# Altium schematic sheet main.SchDoc
size A; SheetNumber: 1; SheetTotal: 1
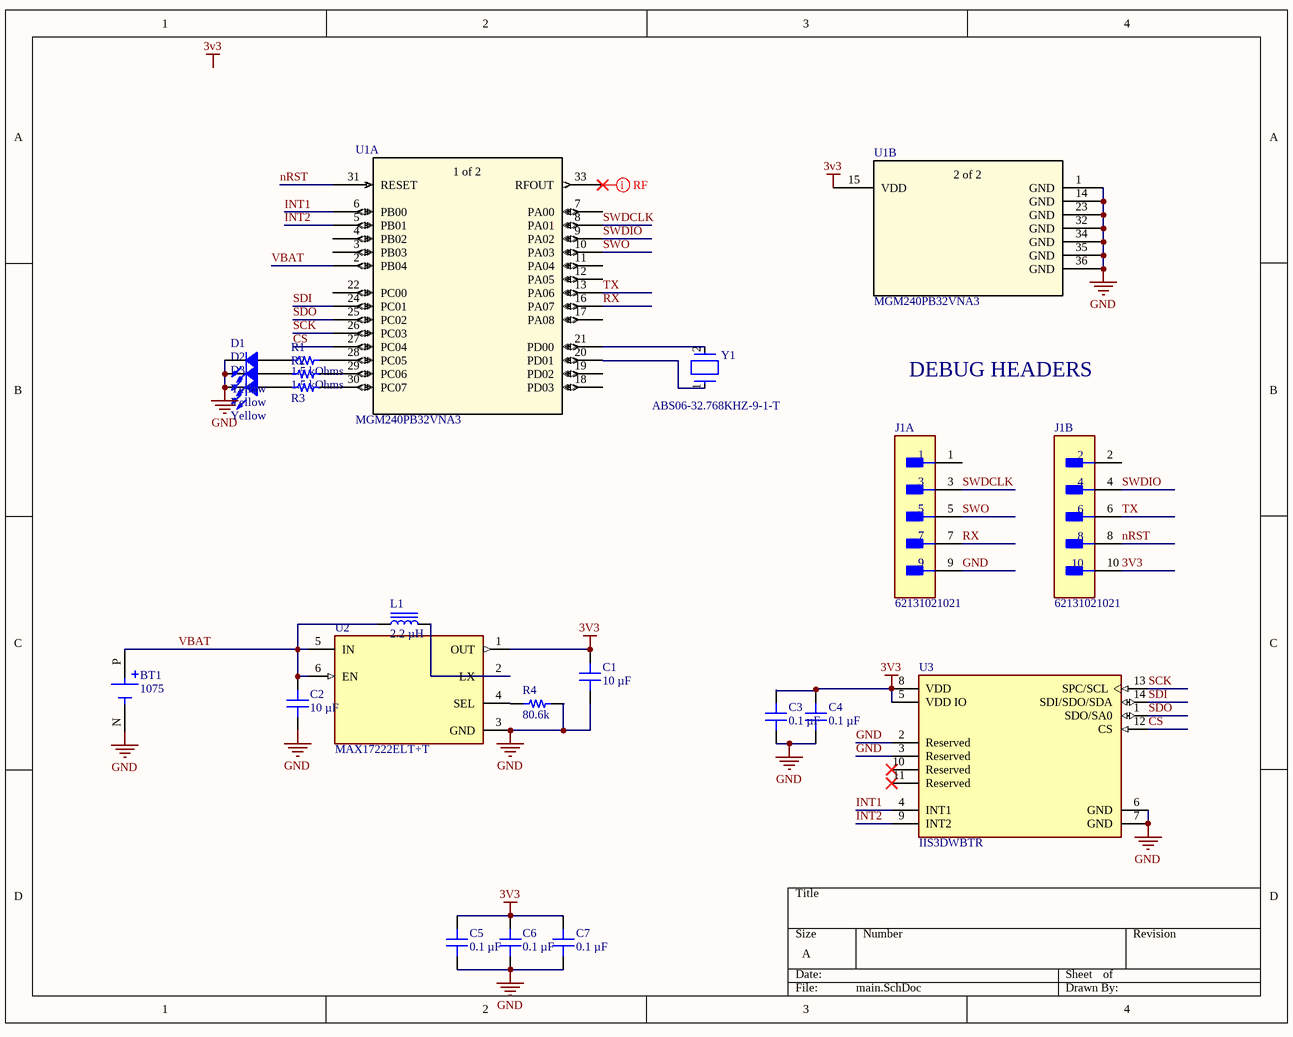
[diagram p0: main.SchDoc]

## Parts
BT1  1075  [BAT_1075]
C1  10 µF  [CAP 0402_1005]
C2  10 µF  [CAP 0402_1005]
C3  0.1 µF  [CAP 0402_1005]
C4  0.1 µF  [CAP 0402_1005]
C5  0.1 µF  [CAP 0402_1005]
C6  0.1 µF  [CAP 0402_1005]
C7  0.1 µF  [CAP 0402_1005]
D1  Yellow  [LED 0402_1005 YELLOW]
D2  Yellow  [LED 0402_1005 YELLOW]
D3  Yellow  [LED 0402_1005 YELLOW]
J1  62131021021  [FP-62131021021-MFG]  (parts A,B of 2)
L1  2.2 µH  [TDK VLS201612CX]
R1  1.5 kOhms  [RES 0402_1005]
R2  1.5 kOhms  [RES 0402_1005]
R3  (no value)  [RES 0402_1005]
R4  80.6k  [RES 0402_1005]
U1  MGM240PB32VNA3  [xGM240P]  (parts A,B of 2)
U2  MAX17222ELT+T  [FP-L622-1C-IPC_B]
U3  IIS3DWBTR  [FP-LGA-14L-DM00249496-MFG]
Y1  ABS06-32.768KHZ-9-1-T  [FP-ABS06-MFG]

## Nets
3V3: C1.1 C3.2 C4.2 C5.2 C6.2 C7.2 J1.10 U1.15(VDD) U2.1(OUT) U3.5(VDD_IO) U3.8(VDD)
GND: BT1.N(NEG) C1.2 C2.2 C3.1 C4.1 C5.1 C6.1 C7.1 D1.2 D2.2 D3.2 J1.9 R4.1 U1.1(GND) U1.14(GND) U1.23(GND) U1.32(GND) U1.34(GND) U1.35(GND) U1.36(GND) U2.3(GND) U3.2(Reserved) U3.3(Reserved) U3.6(GND) U3.7(GND)
CS: U1.27(PC04) U3.12(CS)
INT1: U1.6(PB00) U3.4(INT1)
INT2: U1.5(PB01) U3.9(INT2)
nRST: J1.8 U1.31(RESET)
RX: J1.7 U1.16(PA07)
SCK: U1.26(PC03) U3.13(SPC/SCL)
SDI: U1.24(PC01) U3.14(SDI/SDO/SDA)
SDO: U1.25(PC02) U3.1(SDO/SA0)
SWDCLK: J1.3 U1.8(PA01)
SWDIO: J1.4 U1.9(PA02)
SWO: J1.5 U1.10(PA03)
TX: J1.6 U1.13(PA06)
VBAT: BT1.P(POS) C2.1 L1.1 U1.2(PB04) U2.5(IN) U2.6(EN)
NetD1_1: D1.1 R1.1
NetD2_1: D2.1 R2.1
NetD3_1: D3.1 R3.1
NetL1_2: L1.2 U2.2(LX)
NetR1_2: R1.2 U1.28(PC05)
NetR2_2: R2.2 U1.29(PC06)
NetR3_2: R3.2 U1.30(PC07)
NetR4_2: R4.2 U2.4(SEL)
NetU1_20: U1.20(PD01) Y1.1
NetU1_21: U1.21(PD00) Y1.2

Not connected (* = marked no-connect by the designer): J1 1 2; U1 3(PB03) 4(PB02) 7(PA00) 11(PA04) 12(PA05) 17(PA08) 18(PD03) 19(PD02) 22(PC00) 33(RFOUT)*; U3 10(Reserved)* 11(Reserved)*

## Layout directives
mark named RF: NetU1_33

## Notes on the sheet
- DEBUG HEADERS
- Labels drawn without touching a wire or pin: 3v3
- (in symbol MGM240PB32VNA3, part A) 1 of 2
- (in symbol MGM240PB32VNA3, part B) 2 of 2

## Library data of the parts
BT1 = CMP-342-000000-1: Price: None; Pin Count: 2; Package: None; Availability: Unavailable; MP: 1075; Value: *; Source: 1075.SchLib; Design Item ID: 1075; Component Type: Standard
C1 C2 = C0402C104K7PAC7867: CAP CER 0.1UF 4V X5R 0402; manufacturer: KEMET; Capacitance: 0.1 µF; Tolerance: ±10%; Part Number: C0402C104K7PAC7867; Value: 10 µF; Applications: Bypass, Decoupling; componentlink1description: Datasheet; componentlink1url: https://api.kemet.com/component-edge/download/datasheet/C0402C104K7PAC7867.pdf; componentlink2description: DigiKey Link; componentlink2url: https://www.digikey.com/en/products/detail/kemet/C0402C104K7PAC7867/7381987; Device Package: 0402 (1005 Metric); lastupdated: 1/9/2022 12:30:40 pm; Lifecycle Status: Active; Minimum Order: 1; Mounting Type: Surface Mount, MLCC; Operating Temperature: -55°C ~ 85°C; Package / Case: 0402 (1005 Metric); packaging: TapeAndReel; partid: 5603; Part Status: Active; price: 0.01; series: SMD Comm X5R; Size / Dimension: 0.039" L x 0.020" W (1.00mm x 0.50mm); Supplier 1: DigiKey; Supplier Part Number 1: 399-14871-1-ND; Temperature Coefficient: X5R; Thickness (Max): 0.022" (0.55mm); Voltage - Rated: 4V
C3 C4 C6 C7 = C0402C104K7PAC7867: CAP CER 0.1UF 4V X5R 0402; manufacturer: KEMET; Tolerance: ±10%; Part Number: C0402C104K7PAC7867; Value: 0.1 µF; Applications: Bypass, Decoupling; Capacitance: 0.1 µF; componentlink1description: Datasheet; componentlink1url: https://api.kemet.com/component-edge/download/datasheet/C0402C104K7PAC7867.pdf; componentlink2description: DigiKey Link; componentlink2url: https://www.digikey.com/en/products/detail/kemet/C0402C104K7PAC7867/7381987; Device Package: 0402 (1005 Metric); lastupdated: 1/9/2022 12:30:40 pm; Lifecycle Status: Active; Minimum Order: 1; Mounting Type: Surface Mount, MLCC; Operating Temperature: -55°C ~ 85°C; Package / Case: 0402 (1005 Metric); packaging: TapeAndReel; partid: 5603; Part Status: Active; price: 0.01; series: SMD Comm X5R; Size / Dimension: 0.039" L x 0.020" W (1.00mm x 0.50mm); Supplier 1: DigiKey; Supplier Part Number 1: 399-14871-1-ND; Temperature Coefficient: X5R; Thickness (Max): 0.022" (0.55mm); Voltage - Rated: 4V
C5 = C0402C104K4RECAUTO: CAP CER 0402 0.1UF 16V X7R 10%; manufacturer: KEMET; Part Number: C0402C104K4RECAUTO; Value: 0.1 µF; Applications: Automotive, ESD Protection; Capacitance: 0.1 µF; componentlink1description: Datasheet; componentlink1url: https://api.kemet.com/component-edge/download/datasheet/C0402C104K4RECAUTO.pdf; componentlink2description: DigiKey Link; componentlink2url: https://www.digikey.com/en/products/detail/kemet/C0402C104K4RECAUTO/8563695; Device Package: 0402 (1005 Metric); lastupdated: 1/9/2022 12:30:53 pm; Lifecycle Status: Active; Minimum Order: 1; Mounting Type: Surface Mount, MLCC; Operating Temperature: -55°C ~ 125°C; Package / Case: 0402 (1005 Metric); packaging: TapeAndReel; partid: 1731; Part Status: Active; price: 0.01; Ratings: AEC-Q200; series: ESD SMD Auto X7R; Size / Dimension: 0.039" L x 0.020" W (1.00mm x 0.50mm); Supplier 1: DigiKey; Supplier Part Number 1: 399-17167-1-ND; Temperature Coefficient: X7R; Thickness (Max): 0.022" (0.55mm); Tolerance: ±10%; Voltage - Rated: 16V
D1-D3 = BL-HKC37A-AV-TRB: 0402 YELLOW; Manufacturer: American Bright Optoelectronics Corporation; Configuration: Standard; Current - Test: 20mA; Lens Color: Colorless; Lens Style: Rectangle with Flat Top; Lens Transparency: Clear; Millicandela Rating: 120mcd; Viewing Angle: 120°; Voltage - Forward (Vf) (Typ): 2.2V; Wavelength - Dominant: 589nm; Wavelength - Peak: 590nm; Part Number: BL-HKC37A-AV-TRB; Color: Yellow; ComponentLink1Description: Datasheet; ComponentLink1URL: https://americanbrightled.com/pdffiles/smt/BL-HKC37A-AV-TRB.pdf; ComponentLink2Description: DigiKey Link; ComponentLink2URL: https://www.digikey.com/en/products/detail/american-bright-optoelectronics-corporation/BL-HKC37A-AV-TRB/9678171; Device Package: 0402 (1005 Metric); Height (Max): 0.45mm; LastUpdated: 11/9/2022 10:29:51 am; Lifecycle Status: Active; Minimum Order: 1; Mounting Type: Surface Mount; Package / Case: 0402 (1005 Metric); Packaging: TapeAndReel; PartId: 1041; Part Status: Active; Price: 0.06; Series: -; Size / Dimension: 1.00mm L x 0.50mm W; Supplier 1: DigiKey; Supplier Part Number 1: BL-HKC37A-AV-TRBCT-ND; Supplier Device Package: 0402; Value: Yellow
J1 = CMP-1502-00938-2: 1.27mm SMT Straight Dual Pin Header WR-PHD; RoHS Compliant: Yes
L1 = VLS201612CX-6R8M-1: FIXED IND 6.8UH 930MA 368MOHM SM; Manufacturer: TDK Corporation; Current - Saturation: 730mA; DC Resistance (DCR): 368mOhm Max; Inductance: 6.8 µH; Inductance Frequency - Test: 1 MHz; Material - Core: Ferrite; Shielding: Shielded; Tolerance: ±20%; Type: Drum Core, Wirewound; Part Number: VLS201612CX-6R8M-1; ComponentLink1Description: Datasheet; ComponentLink1URL: https://product.tdk.com/info/en/catalog/datasheets/inductor_commercial_power_vls201612cx-1_en.pdf?ref_disty=digikey; ComponentLink2Description: DigiKey Link; ComponentLink2URL: https://www.digikey.com/en/products/detail/tdk-corporation/VLS201612CX-6R8M-1/5169771; Current Rating (Amps): 930 mA; Device Package: Nonstandard; Height - Seated (Max): 0.047" (1.20mm); LastUpdated: 11/9/2022 10:31:03 am; Lifecycle Status: Active; Minimum Order: 1; Mounting Type: Surface Mount; Operating Temperature: -40°C ~ 105°C; Package / Case: Nonstandard; Packaging: TapeAndReel; PartId: 207; Part Status: Active; Price: 0.13; Series: VLS-CX-1; Size / Dimension: 0.079" L x 0.063" W (2.00mm x 1.60mm); Supplier 1: DigiKey; Supplier Part Number 1: 445-172966-1-ND; Supplier Device Package: 2016; Value: 2.2 µH
R1 R2 = ERA-2VRW1501X: RES 1.5K OHM 0.05% 1/10W 0402; Manufacturer: Panasonic Electronic Components; Power (Watts): 0.1W, 1/10W; Temperature Coefficient: ±10ppm/°C; Part Number: ERA-2VRW1501X; Value: 1.5 kOhms; ComponentLink1Description: Datasheet; ComponentLink1URL: https://api.pim.na.industrial.panasonic.com/file_stream/main/fileversion/9152; ComponentLink2Description: DigiKey Link; ComponentLink2URL: https://www.digikey.com/en/products/detail/panasonic-electronic-components/ERA-2VRW1501X/12086957; Composition: Thin Film; Device Package: 0402 (1005 Metric); Features: Anti-Sulfur, Automotive AEC-Q200; Height - Seated (Max): 0.016" (0.40mm); LastUpdated: 11/9/2022 9:53:08 am; Lifecycle Status: Active; Minimum Order: 1; Number of Terminations: 2; Operating Temperature: -55°C ~ 155°C; Package / Case: 0402 (1005 Metric); Packaging: TapeAndReel; PartId: 67400; Part Status: Active; Price: 0.24; Ratings: AEC-Q200; Resistance: 1.5 kOhms; Series: ERA-2V; Size / Dimension: 0.039" L x 0.020" W (1.00mm x 0.50mm); Supplier 1: DigiKey; Supplier Part Number 1: 10-ERA-2VRW1501XCT-ND; Supplier Device Package: 0402; Tolerance: ±0.05%
R3 R4 = ERA-2VRW1501X: RES 1.5K OHM 0.05% 1/10W 0402; Manufacturer: Panasonic Electronic Components; Power (Watts): 0.1W, 1/10W; Resistance: 1.5 kOhms; Temperature Coefficient: ±10ppm/°C; Part Number: ERA-2VRW1501X; ComponentLink1Description: Datasheet; ComponentLink1URL: https://api.pim.na.industrial.panasonic.com/file_stream/main/fileversion/9152; ComponentLink2Description: DigiKey Link; ComponentLink2URL: https://www.digikey.com/en/products/detail/panasonic-electronic-components/ERA-2VRW1501X/12086957; Composition: Thin Film; Device Package: 0402 (1005 Metric); Features: Anti-Sulfur, Automotive AEC-Q200; Height - Seated (Max): 0.016" (0.40mm); LastUpdated: 11/9/2022 9:53:08 am; Lifecycle Status: Active; Minimum Order: 1; Number of Terminations: 2; Operating Temperature: -55°C ~ 155°C; Package / Case: 0402 (1005 Metric); Packaging: TapeAndReel; PartId: 67400; Part Status: Active; Price: 0.24; Ratings: AEC-Q200; Series: ERA-2V; Size / Dimension: 0.039" L x 0.020" W (1.00mm x 0.50mm); Supplier 1: DigiKey; Supplier Part Number 1: 10-ERA-2VRW1501XCT-ND; Supplier Device Package: 0402; Tolerance: ±0.05%
  R4: Value: 80.6k
U1 = MGM240PB32VNA3: No Description Available; Mfr_Name: Silicon Labs; RefDes: RefDes; Type: Type
U2 = CMP-05722-000389-1: IC REG BOOST ADJ 500MA 6UDFN; Max Output Voltage: 5V; Number of Outputs: 1; Switching Frequency: 2.5MHz; Output Type: Adjustable; Synchronous Rectifier: Yes; Max Input Voltage: 5.5V; Output Configuration: Positive; Min Output Voltage: 1.8V; Min Input Voltage: 400mV; Min Operating Temperature: -40°C; RoHS Compliant: Yes; Packaging: Tape and Reel; Topology: Boost; Output Current: 500mA; Mount: Surface Mount; Number of Pins: 6; Max Operating Temperature: 85°C
U3 = CMP-12175-000007-1: ULTRA-WIDE BANDWIDTH, LOW-NOISE; Manufacturer: STMicroelectronics; Accel Range: 2/4/8/16g; Operating Supply Current: 1.1mA; Accel Axis: X+Y and Z; Frequency: 6.3kHz; Sensor Output: I2C,SPI; Max Supply Voltage: 3.6V; Min Supply Voltage: 2.1V; Accel Sensitivity: 61-488LSB/g; Height: 0.86mm; Octopart: https://octopart.com/iis3dwbtr-stmicroelectronics-107245748; Automotive: No; Category: IC; Device Class L3: Accelerometers; Device Class L2: Motion Sensors; Digikey Description: ULTRA-WIDE BANDWIDTH, LOW-NOISE; Temperature Range High: +105°C; RoHS: TRUE; Package: LGA-14L-DM00249496; Device Class L1: Sensors; ComponentLink2Description: Datasheet; Temperature Range Low: -40°C; Footprint Url: https://www.st.com/content/ccc/resource/technical/document/technical_note/73/17/9c/16/dd/96/4a/01/CD00134799.pdf/files/CD00134799.pdf/jcr:content/translations/en.CD00134799.pdf; Temperature: -40°C to +105°C; Lead Free: Yes; ComponentLink2URL: https://www.st.com/content/ccc/resource/technical/document/datasheet/group3/14/0e/2b/1d/77/d0/46/f6/DM00501492/files/DM00501492.pdf/jcr:content/translations/en.DM00501492.pdf; Manufacturer Part Number: IIS3DWBTR
Y1 = CMP-27762-003430-2: Crystal 32.768kHz ±10ppm (Tol) 9pF FUND 90kΩ 2-Pin Mini-CSMD T/R; Series Resistance: 90kR; Series: ABS06; Case/Package: CSMD; Package Quantity: 3000; Load Capacitance: 9pF; Number of Pins: 2; Tolerance: 10ppm; RoHS Compliant: Yes; Depth: 1.2mm; Termination: SMD/SMT; Min Operating Temperature: -40°C; Length: 2mm; Packaging: Tape and Reel; Max Operating Temperature: 85°C; Frequency Tolerance: 10ppm; Width: 1.2mm; ESR (Equivalent Series Resistance): 90kR; Radiation Hardening: No; Frequency: 32.768kHz; REACH SVHC: No SVHC; Mount: Surface Mount; Height: 0.6mm